# Altium schematic sheet 1-to-8_Fanout.SchDoc: 1:8 Fanout
size A3; Author: M.Beldyga; CompanyName: WUT ISE; DrawnBy: M.Beldyga; Organization: WUT ISE; Address1: PW ISE; Address2: Nowowiejska 15/19 00-665 Warsaw; Address3: micbeldyga@gmail.com; SheetNumber: 3; SheetTotal: 8; ModifiedBy: -; CheckedDate: -; DivGrp: WUT ISE; Designer: M.Beldyga; ModifiedDate: -; ProjectName: Sensor Box
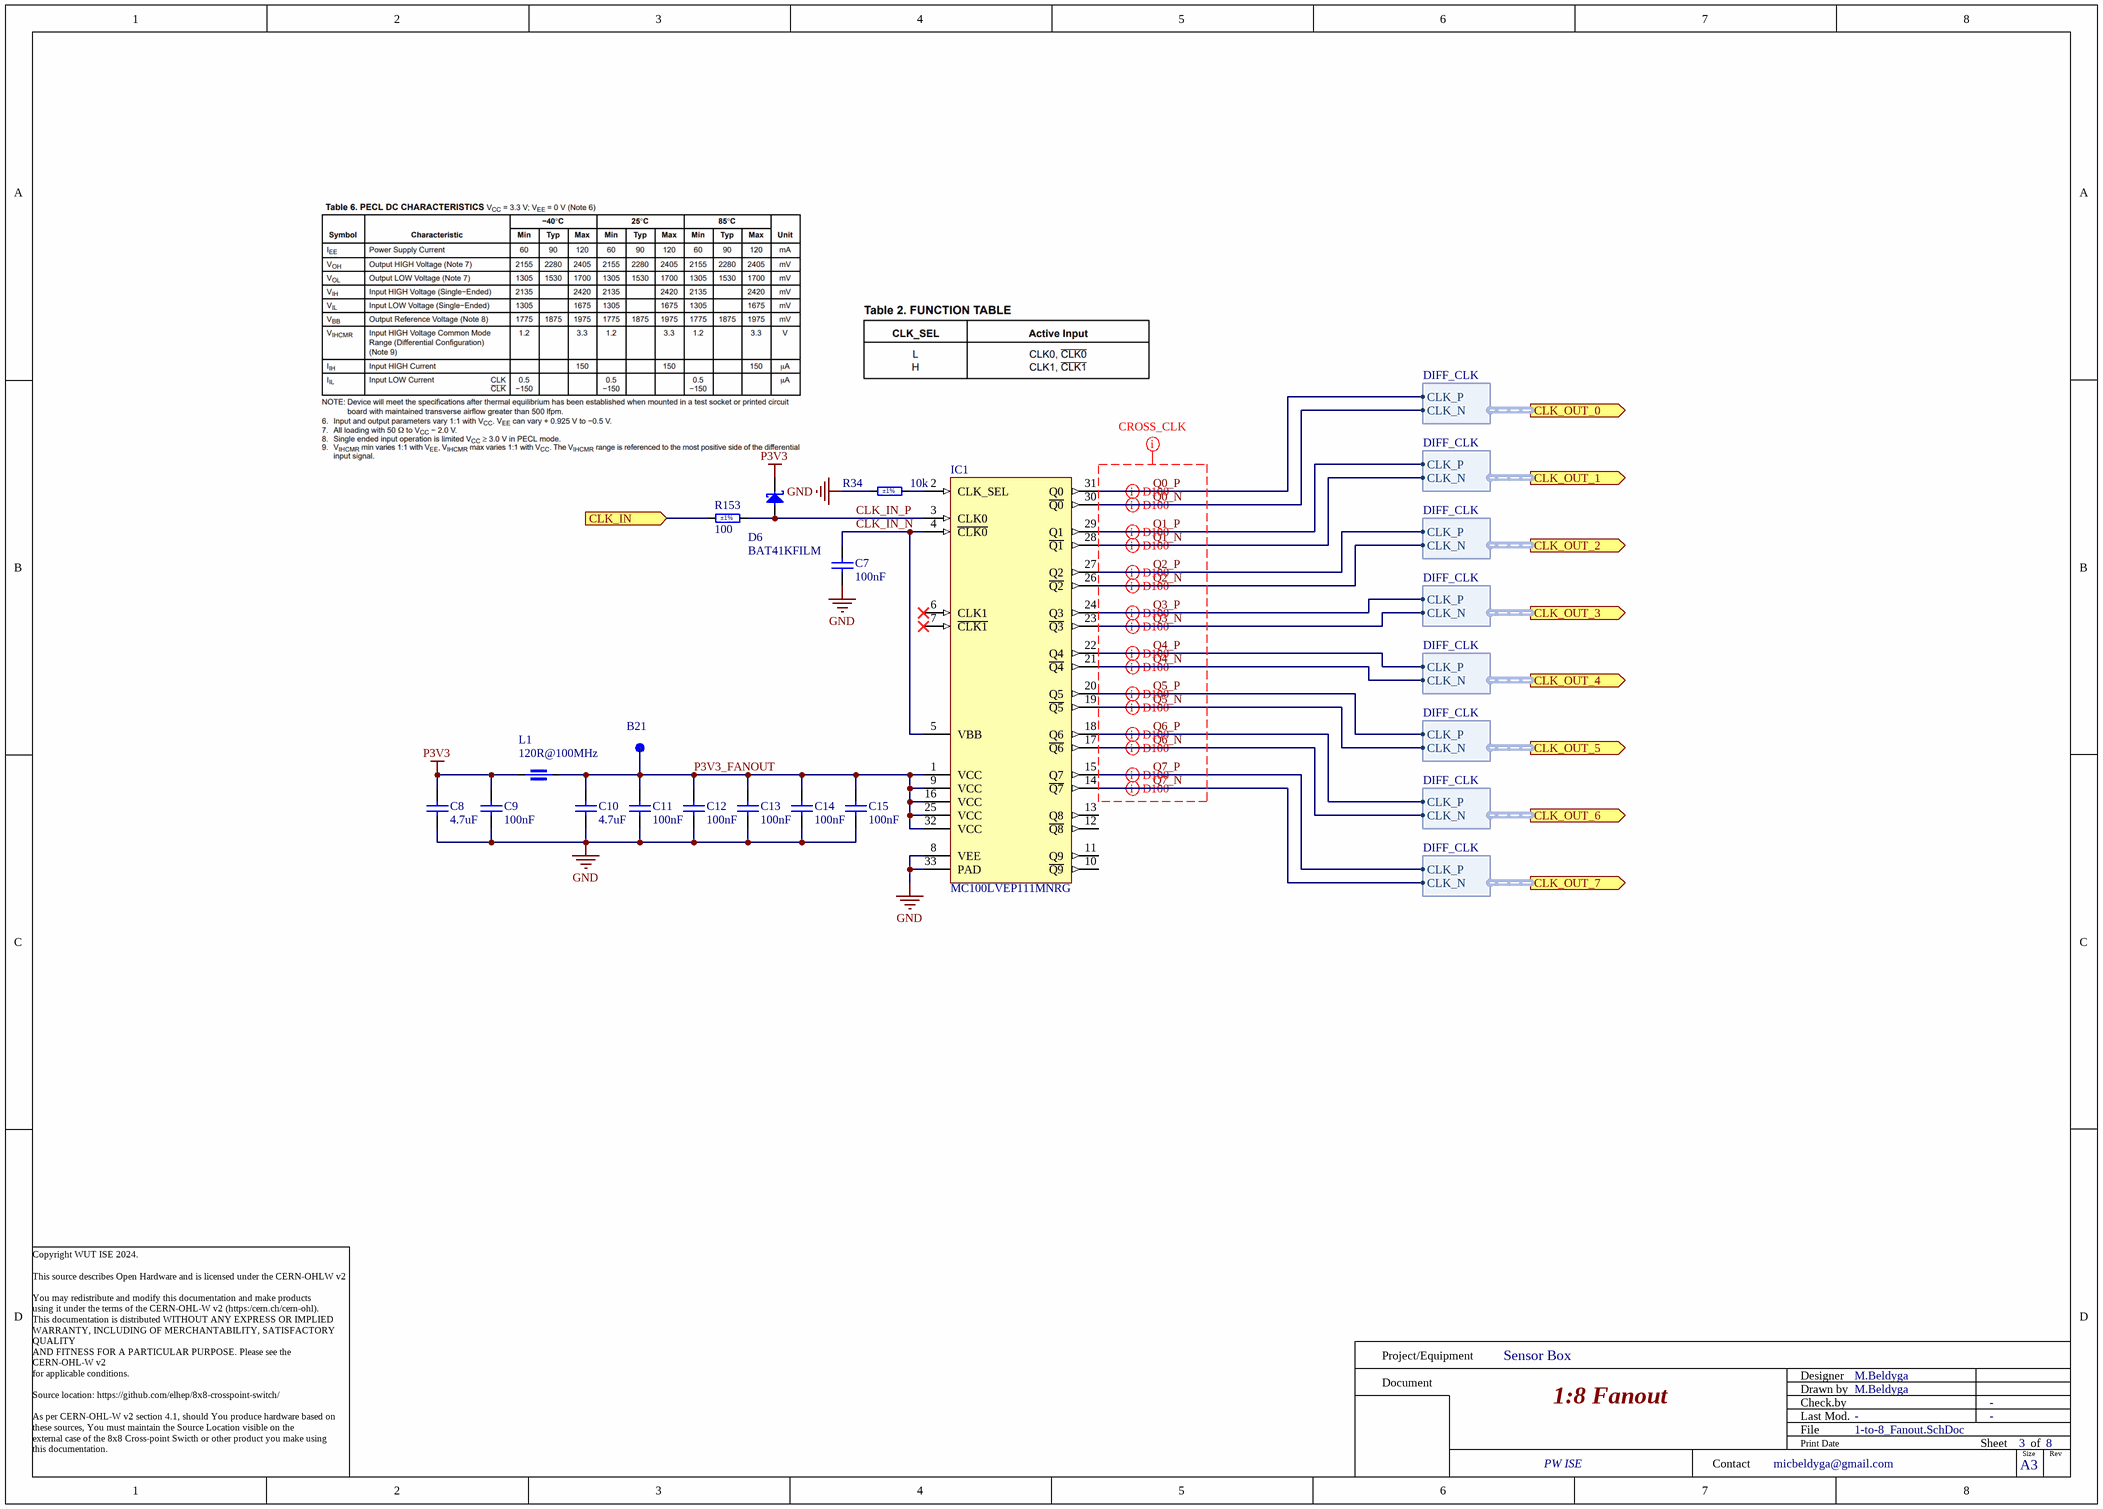
[diagram p0: 1-to-8_Fanout.SchDoc]

## Parts
B21  SMD Pad  [C100]  (value not drawn)  (no BOM)
C7  100nF  [CAPC1005X55N]
C8  4.7uF  [CAPC1608X90N]
C9  100nF  [CAPC1005X55N]
C10  4.7uF  [CAPC1608X90N]
C11  100nF  [CAPC1005X55N]
C12  100nF  [CAPC1005X55N]
C13  100nF  [CAPC1005X55N]
C14  100nF  [CAPC1005X55N]
C15  100nF  [CAPC1005X55N]
D6  BAT41KFILM  [SODFL1608X70N]
IC1  MC100LVEP111MNRG  [QFN50P500X500X100_HS-33N]
L1  120R@100MHz  [INDC1608X65N]
R34  10k  Tolerance: ±1%  [RESC1005X40N]
R153  100  Tolerance: ±1%  [RESC1005X40N]

## Ports
CLK_IN (in), CLK_OUT_0 (out, harness DIFF_CLK), CLK_OUT_1 (out, harness DIFF_CLK), CLK_OUT_2 (out, harness DIFF_CLK), CLK_OUT_3 (out, harness DIFF_CLK), CLK_OUT_4 (out, harness DIFF_CLK), CLK_OUT_5 (out, harness DIFF_CLK), CLK_OUT_6 (out, harness DIFF_CLK), CLK_OUT_7 (out, harness DIFF_CLK)

## Harnesses
DIFF_CLK: CLK_P, CLK_N

## Nets
GND: C7.1 C8.1 C9.1 C10.1 C11.1 C12.1 C13.1 C14.1 C15.1 IC1.8(VEE) IC1.33(PAD) R34.2
P3V3: C8.2 C9.2 D6.1(C) L1.1
CLK_IN: R153.1 ; port CLK_IN
CLK_IN_N: C7.2 IC1.4(~{CLK0}) IC1.5(VBB)
CLK_IN_P: D6.2(A) IC1.3(CLK0) R153.2
P3V3_FANOUT: B21.1 C10.2 C11.2 C12.2 C13.2 C14.2 C15.2 IC1.1(VCC) IC1.9(VCC) IC1.16(VCC) IC1.25(VCC) IC1.32(VCC) L1.2
Q0_N: IC1.30(~{Q0}) ; port CLK_OUT_0.CLK_N
Q0_P: IC1.31(Q0) ; port CLK_OUT_0.CLK_P
Q1_N: IC1.28(~{Q1}) ; port CLK_OUT_1.CLK_N
Q1_P: IC1.29(Q1) ; port CLK_OUT_1.CLK_P
Q2_N: IC1.26(~{Q2}) ; port CLK_OUT_2.CLK_N
Q2_P: IC1.27(Q2) ; port CLK_OUT_2.CLK_P
Q3_N: IC1.23(~{Q3}) ; port CLK_OUT_3.CLK_N
Q3_P: IC1.24(Q3) ; port CLK_OUT_3.CLK_P
Q4_N: IC1.21(~{Q4}) ; port CLK_OUT_4.CLK_N
Q4_P: IC1.22(Q4) ; port CLK_OUT_4.CLK_P
Q5_N: IC1.19(~{Q5}) ; port CLK_OUT_5.CLK_N
Q5_P: IC1.20(Q5) ; port CLK_OUT_5.CLK_P
Q6_N: IC1.17(~{Q6}) ; port CLK_OUT_6.CLK_N
Q6_P: IC1.18(Q6) ; port CLK_OUT_6.CLK_P
Q7_N: IC1.14(~{Q7}) ; port CLK_OUT_7.CLK_N
Q7_P: IC1.15(Q7) ; port CLK_OUT_7.CLK_P
NetIC1_2: IC1.2(CLK_SEL) R34.1

Not connected (* = marked no-connect by the designer): IC1 6(CLK1)* 7(~{CLK1})* 10(~{Q9}) 11(Q9) 12(~{Q8}) 13(Q8)

## Layout directives
differential pair; net class D100: Q0_N, Q0_P, Q1_N, Q1_P, Q2_N, Q2_P, Q3_N, Q3_P, Q4_N, Q4_P, Q5_N, Q5_P, Q6_N, Q6_P, Q7_N, Q7_P
net class CROSS_CLK: Q0_N, Q0_P, Q1_N, Q1_P, Q2_N, Q2_P, Q3_N, Q3_P, Q4_N, Q4_P, Q5_N, Q5_P, Q6_N, Q6_P, Q7_N, Q7_P

## Notes on the sheet
- Copyright WUT ISE 2024.
  This source describes Open Hardware and is licensed under the CERN-OHLW v2
  You may redistribute and modify this documentation and make products
  using it under the terms of the CERN-OHL-W v2 (https:/cern.ch/cern-ohl).
  This documentation is distributed WITHOUT ANY EXPRESS OR IMPLIED
  WARRANTY, INCLUDING OF MERCHANTABILITY, SATISFACTORY QUALITY
  AND FITNESS FOR A PARTICULAR PURPOSE. Please see the CERN-OHL-W v2
  for applicable conditions.
  Source location: https://github.com/elhep/8x8-crosspoint-switch/
  As per CERN-OHL-W v2 section 4.1, should You produce hardware based on
  these sources, You must maintain the Source Location visible on the
  external case of the 8x8 Cross-point Swicth or other product you make using
  this documentation.
- Project/Equipment
- Document
- Designer
- Drawn by
- Check.by
- Contact
- File
- Last Mod.
- Print Date
- Sheet
- Size
- A3
- of
- Rev

## Library data of the parts
B21 = SMD_PAD_D1MM: Pad; Part Description: 1mm Diameter SMD Pad; Mounted: No; Part Number: SMD_PAD_D1MM; Component Type: Standard (No BOM); Pin Count: 1; Family: SMD Pad; Socket: No; SMD: Yes; Sense: No; Status: None; ComponentHeight: 0mm; HelpURL: Undefined; Author: CERN DEM JLC; CreateDate: 10/10/2017; LatestRevisionDate: 10/10/2017; PackageDescription: 1mm Diameter SMD Pad
C7 C9 C11-C15 = CC0402_100NF_50V_10%_X7R: Non-polarised capacitor; Part Description: SMD Multilayer Chip Ceramic Capacitor; Manufacturer: GENERIC; Manufacturer1 Part Number: GRM155R71H104KE14D; Voltage: 50V; TC: X7R; Tolerance: ±10%; Part Number: CC0402_100NF_50V_10%_X7R; Component Kind: Standard; Component Type: Standard; Pin Count: 2; Value: 100nF; Status: None; Manufacturer Part Number: CC0402_100NF_50V_10%_X7R; Case: 0402; Mounted: Yes; Socket: No; SMD: Yes; Sense: No; Manufacturer1 Example: MURATA; Manufacturer1 ComponentHeight: 0.55mm; HelpURL: \\cern.ch\dfs\Applications\Altium\Datasheets\CC0402_MURATA_GRM155R71H104KE14D.pdf; Author: CERN DEM MR; CreateDate: 6/30/2017; LatestRevisionDate: 6/30/2017
C8 C10 = CC0603_4.7UF_25V_10%_X5R: Non-polarised capacitor; Part Description: SMD Multilayer Chip Ceramic Capacitor; Manufacturer: GENERIC; Manufacturer1 Part Number: GRM188R61E475KE11D; Voltage: 25V; TC: X5R; Tolerance: ±10%; Part Number: CC0603_4.7UF_25V_10%_X5R; Component Kind: Standard; Component Type: Standard; Pin Count: 2; Value: 4.7uF; Status: None; Manufacturer Part Number: CC0603_4.7UF_25V_10%_X5R; Case: 0603; Mounted: Yes; Socket: No; SMD: Yes; Sense: No; Manufacturer1 Example: MURATA; Manufacturer1 ComponentHeight: 0.95mm; HelpURL: \\cern.ch\dfs\Applications\Altium\Datasheets\CC0603_MURATA_GRM188R61E475KE11D.pdf; Author: CERN DEM JLC; CreateDate: 11/10/2014; LatestRevisionDate: 11/10/2014
D6 = BAT41KFILM: Low Capacitance Small Signal 200 mA 1 V Schottky Diode Surface Mount - SOD-523; Manufacturer: STMicroelectronics; Supplier: Mouser; Supplier Part Number: 511-BAT41KFILM; Manufacturer Part Number: BAT41KFILM; RoHS: Yes; Category: Rectifier Diodes; Stock: 214027; Pricing: 1=0.38, 10=0.264, 50=0.264, 100=0.109, 1000=0.081, 10000=0.056 (USD); ComponentLink1URL: https://datasheet.ciiva.com/22733/1689714-22733174.pdf?src-supplier=Element14; ComponentLink1Description: https://datasheet.ciiva.com/22733/1689714-22733174.pdf?src-supplier=Element14; ComponentLink2URL: https://datasheet.ciiva.com/16421/cd00130227-16421663.pdf?src-supplier=Future+Electronics; ComponentLink2Description: https://datasheet.ciiva.com/16421/cd00130227-16421663.pdf?src-supplier=Future+Electronics; ComponentLink3URL: https://datasheet.ciiva.com/915/cd00130227-915701.pdf?src-supplier=Digikey; ComponentLink3Description: https://datasheet.ciiva.com/915/cd00130227-915701.pdf?src-supplier=Digikey; ComponentLink4URL: https://datasheet.ciiva.com/915/cd00130227-915702.pdf?src-supplier=Digikey; ComponentLink4Description: https://datasheet.ciiva.com/915/cd00130227-915702.pdf?src-supplier=Digikey; ComponentLink5URL: https://datasheet.ciiva.com/915/cd00130227-915703.pdf?src-supplier=Digikey; ComponentLink5Description: https://datasheet.ciiva.com/915/cd00130227-915703.pdf?src-supplier=Digikey
IC1 = MC100LVEP111MNRG: 2.5 V / 3.3 V 2: 1: 10 Differential ECL/PECL/HSTL Clock / Data Fanout Buffer; Manufacturer: ON Semiconductor; Supplier: Digikey; Supplier Part Number: 488-MC100LVEP111MNRGCT-ND; Manufacturer Part Number: MC100LVEP111MNRG; RoHS: Yes; Category: Clock Buffers, Drivers; Stock: 1000; Pricing: 1=7.77, 10=7.02, 25=6.6932, 100=5.8117, 250=5.55056, 500=5.0608 (USD); ComponentLink1URL: https://datasheet.ciiva.com/8255/mc100lvep111-d-8255826.pdf?src-supplier=Avnet; ComponentLink1Description: https://datasheet.ciiva.com/8255/mc100lvep111-d-8255826.pdf?src-supplier=Avnet; ComponentLink2URL: https://datasheet.ciiva.com/6671/mc100lvep111-d-6671100.pdf?src-supplier=Digikey; ComponentLink2Description: https://datasheet.ciiva.com/6671/mc100lvep111-d-6671100.pdf?src-supplier=Digikey
L1 = IND0603_MURATA_BLM18SG121TN1D: Part Description: SMD EMIFIL Suppression Chip Ferrite Bead; Manufacturer: MURATA; Power: 3A; Resistance: 0.025R; Tolerance: ±25%; Part Number: IND0603_MURATA_BLM18SG121TN1D; Component Kind: Standard; Component Type: Standard; Pin Count: 2; Value: 120R@100MHz; Manufacturer Part Number: BLM18SG121TN1D; Case: 0603; Mounted: Yes; Socket: No; SMD: Yes; Sense: No; ComponentHeight: 0.65mm; HelpURL: \\cern.ch\dfs\Applications\Altium\Datasheets\IND0603_MURATA_BLM18S.pdf; Author: CERN DEM JLC; CreateDate: 7/23/2014; LatestRevisionDate: 10/25/2018
R34 = R0402_10K_1%_0.0625W_100PPM: Resistor - 1%; Part Description: General Purpose Thick Film Chip Resistor; Manufacturer: GENERIC; Manufacturer1 Part Number: 232270671003L; TC: ±100ppm/°C; PressFit: No; Part Number: R0402_10K_1%_0.0625W_100PPM; Component Kind: Standard; Component Type: Standard; Pin Count: 2; Value: 10k; Status: Not Recommended; Power: 0.0625W; Manufacturer Part Number: R0402_10K_1%_0.0625W_100PPM; Case: 0402; Mounted: Yes; Sense: No; Socket: No; SMD: Yes; Manufacturer1 Example: YAGEO PHYCOMP; Manufacturer1 ComponentHeight: 0.4mm; HelpURL: \\cern.ch\dfs\Applications\Altium\Datasheets\R0402_Phycomp_RC0402.pdf; Author: CERN DEM JLC; CreateDate: 12/3/2007; LatestRevisionDate: 10/17/2012
R153 = R0402_100R_1%_0.1W_100PPM: Resistor - 1%; Part Description: General Purpose Thick Film Chip Resistor; Manufacturer: GENERIC; Manufacturer Part Number: R0402_100R_1%_0.1W_100PPM_50V; Manufacturer1 Part Number: ERJ2RKF1000X; Power: 0.1W; TC: ±100ppm/°C; Voltage: 50V; PressFit: No; Part Number: R0402_100R_1%_0.1W_100PPM; Component Kind: Standard; Component Type: Standard; Pin Count: 2; Value: 100; Status: Not Recommended; Case: 0402; Mounted: Yes; Sense: No; Socket: No; SMD: Yes; Manufacturer1 Example: PANASONIC; Manufacturer1 ComponentHeight: 0.4mm; HelpURL: \\cern.ch\dfs\Applications\Altium\Datasheets\R0402_PANASONIC_ERJ2RK.pdf; Author: CERN DEM JLC; CreateDate: 12/12/2013; LatestRevisionDate: 3/3/2015